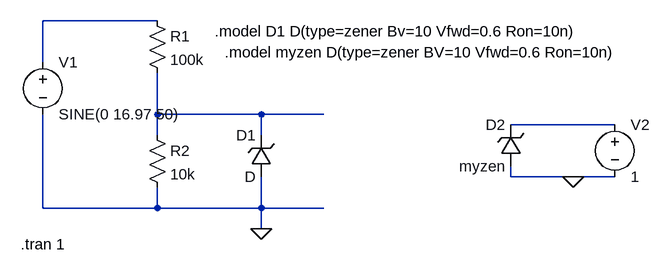
[diagram p0: schematic Draft1.asc]
Draft1.asc, the LTspice schematic file:
Version 4
SHEET 1 1036 680
WIRE 272 80 96 80
WIRE 96 144 96 80
WIRE 272 224 272 160
WIRE 432 224 272 224
WIRE 528 224 432 224
WIRE 976 240 816 240
WIRE 272 256 272 224
WIRE 432 256 432 224
WIRE 816 320 816 304
WIRE 912 320 816 320
WIRE 976 320 912 320
WIRE 96 368 96 224
WIRE 272 368 272 336
WIRE 272 368 96 368
WIRE 432 368 432 320
WIRE 432 368 272 368
WIRE 528 368 432 368
WIRE 432 400 432 368
FLAG 432 400 0
FLAG 912 320 0
SYMBOL voltage 96 128 R0
WINDOW 123 0 0 Left 0
WINDOW 39 0 0 Left 0
SYMATTR InstName V1
SYMATTR Value SINE(0 16.97 50)
SYMBOL res 256 64 R0
SYMATTR InstName R1
SYMATTR Value 100k
SYMBOL res 256 240 R0
SYMATTR InstName R2
SYMATTR Value 10k
SYMBOL zener 448 320 R180
WINDOW 0 24 64 Left 2
WINDOW 3 24 0 Left 2
SYMATTR InstName D1
SYMBOL zener 832 304 R180
WINDOW 0 24 64 Left 2
WINDOW 3 24 0 Left 2
SYMATTR InstName D2
SYMATTR Value myzen
SYMBOL voltage 976 224 R0
WINDOW 123 0 0 Left 0
WINDOW 39 0 0 Left 0
SYMATTR InstName V2
SYMATTR Value 1
TEXT 360 96 Left 2 !.model D1 D(type=zener Bv=10 Vfwd=0.6 Ron=10n)
TEXT 62 424 Left 2 !.tran 1
TEXT 376 128 Left 2 !.model myzen D(type=zener BV=10 Vfwd=0.6 Ron=10n)

The netlist it stands for:
* Draft1.asc
V1 N001 0 SINE(0 16.97 50)
R1 N001 N002 100k
R2 N002 0 10k
D1 0 N002 D
D2 0 N003 myzen
V2 N003 0 1
.model D D
.lib standard.dio
.model D1 D(type=zener Bv=10 Vfwd=0.6 Ron=10n)
.tran 1
.model myzen D(type=zener BV=10 Vfwd=0.6 Ron=10n)
.backanno
.end